# EasyEDA schematic schematic.json
TITLE: Sheet_1; REV: 1.0; Date: 2025-01-16; Sheet: 1/1; Drawn By: saltymold; Company: Your Company
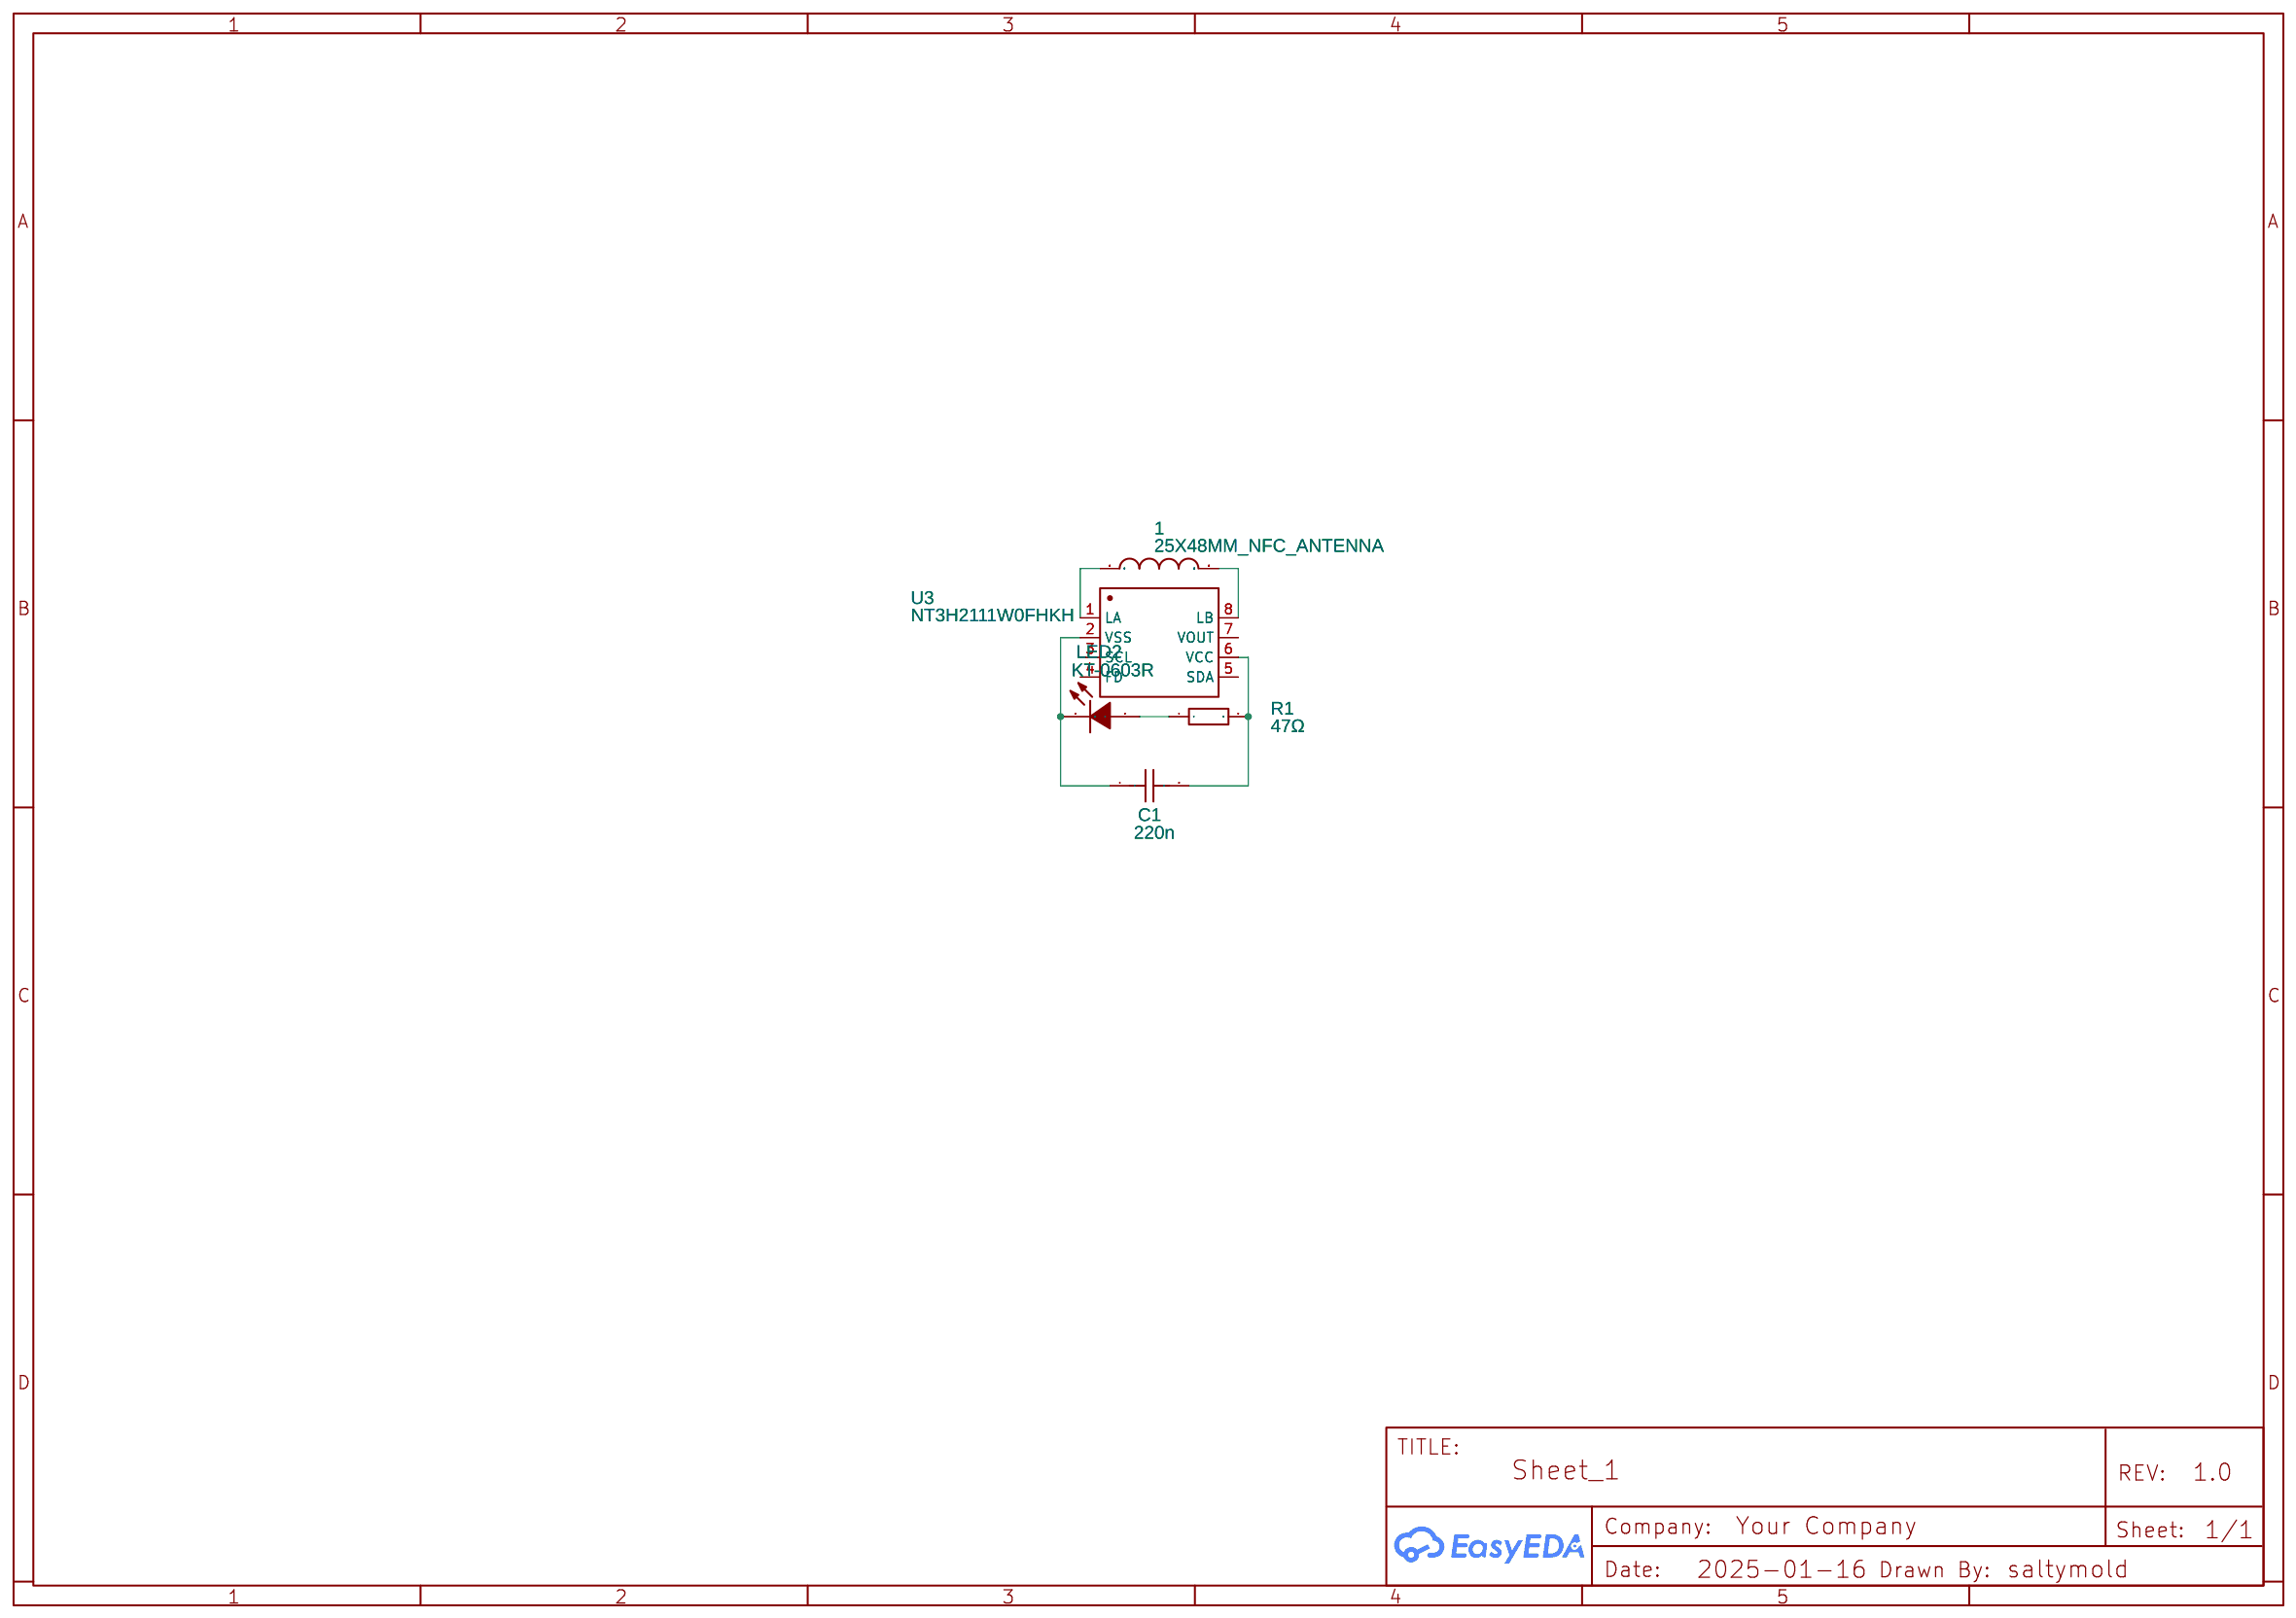
[diagram p0: schematic sheet]

## Parts
1  25X48MM_NFC_ANTENNA  [25X48MM_NFC_ANTENNA]
C1  220n  [C0603]
LED2  KT-0603R  [LED0603-RD]
R1  47Ω  [R0603]
U3  NT3H2111W0FHKH  [XQFN-8_L1.6-W1.6-P0.50-BL_NT3H2111W0FHKH]

## Library data of the parts
1 = 25X48MM_NFC_ANTENNA: Contributor: LoneWalkerWolf
C1 = C_0603_US: Contributor: LCEDA_Lib
LED2 = KT-0603R: Supplier: LCSC; Manufacturer: KENTO; Supplier Part: C2286; JLCPCB Part Class: Basic Part
R1 = 0603WAF470JT5E: Supplier: LCSC; Manufacturer: UNI-ROYAL(厚声); Supplier Part: C23182; JLCPCB Part Class: Basic Part
U3 = NT3H2111W0FHKH: Contributor: LCSC; Supplier: LCSC; Supplier Part: C710403; Manufacturer: NXP(恩智浦); JLCPCB Part Class: Extended Part

## Nets
Net-(1-P$1): 1.P$1 U3.1(LA)
Net-(1-P$2): 1.P$2 U3.8(LB)
Net-(C1-1): C1.1 LED2.1(K) U3.2(VSS)
Net-(C1-2): C1.2 R1.2 U3.6(VCC)
Net-(LED2-2): LED2.2(A) R1.1

Not connected (* = marked no-connect by the designer): U3 3(SCL) 4(FD) 5(SDA) 7(VOUT)
